# Altium schematic sheet 四路电压输入比较器.SchDoc
size 228 x 127 mm
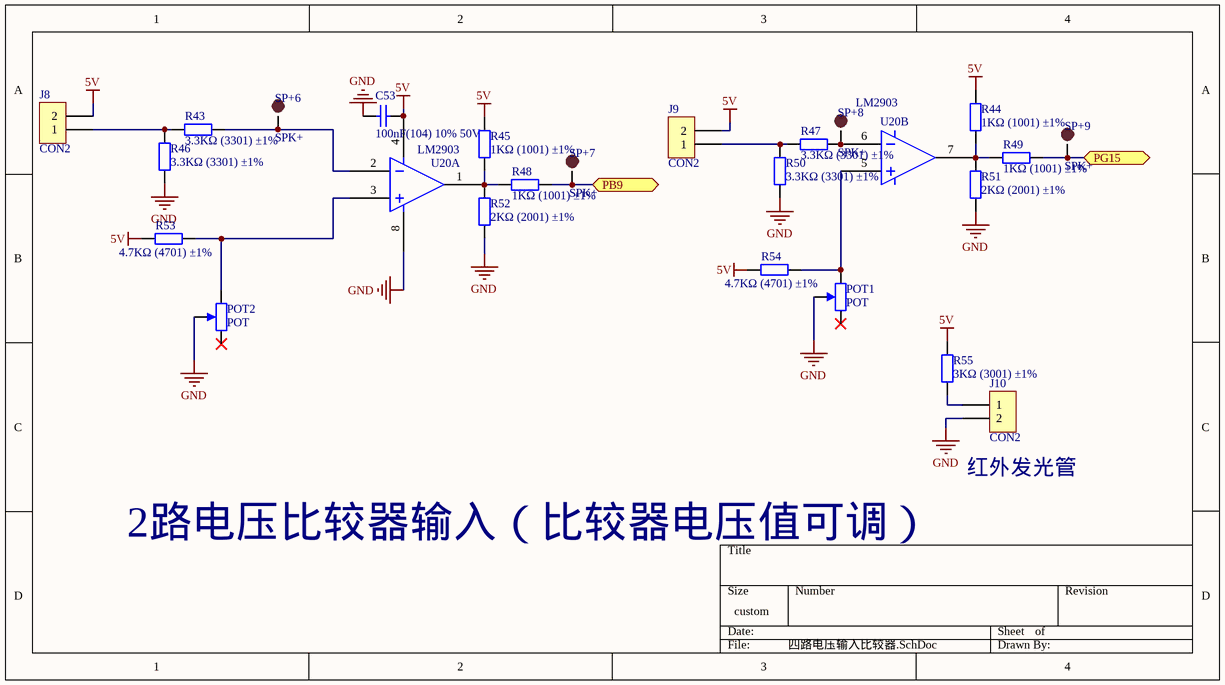
[diagram p0: 四路电压输入比较器.SchDoc]

## Parts
C53  100nF(104) 10% 50V  [0805_C]
J8  CON2  [XH2.54-2P]
J9  CON2  [XH2.54-2P]
J10  CON2  [XH2.54-2P]
POT1  POT  [R09-5K]
POT2  POT  [R09-5K]
R43  3.3KΩ (3301) ±1%  [0805_R]
R44  1KΩ (1001) ±1%  [0805_R]
R45  1KΩ (1001) ±1%  [0805_R]
R46  3.3KΩ (3301) ±1%  [0805_R]
R47  3.3KΩ (3301) ±1%  [0805_R]
R48  1KΩ (1001) ±1%  [0805_R]
R49  1KΩ (1001) ±1%  [0805_R]
R50  3.3KΩ (3301) ±1%  [0805_R]
R51  2KΩ (2001) ±1%  [0805_R]
R52  2KΩ (2001) ±1%  [0805_R]
R53  4.7KΩ (4701) ±1%  [0805_R]
R54  4.7KΩ (4701) ±1%  [0805_R]
R55  3KΩ (3001) ±1%  [0805_R]
SP+6  SPK+  [TP-1.5]
SP+7  SPK+  [TP-1.5]
SP+8  SPK+  [TP-1.5]
SP+9  SPK+  [TP-1.5]
U20  LM2903  [SOP-8]  (parts A,B of 2)

## Ports
PB9, PG15

## Nets
5V: C53.1 J8.2 J9.2 R44.2 R45.2 R53.1 R54.1 R55.2 U20.4
GND: C53.2 J10.2 POT1.2 POT2.2 R46.1 R50.1 R51.1 R52.1 U20.8
PB9: R48.1 SP+7.1 ; port PB9
PG15: R49.1 SP+9.1 ; port PG15
NetJ8_1: J8.1 R43.2 R46.2
NetJ9_1: J9.1 R47.2 R50.2
NetJ10_1: J10.1 R55.1
NetPOT1_3: POT1.3 R54.2 U20.5
NetPOT2_3: POT2.3 R53.2 U20.3
NetR43_1: R43.1 SP+6.1 U20.2
NetR44_1: R44.1 R49.2 R51.2 U20.7
NetR45_1: R45.1 R48.2 R52.2 U20.1
NetR47_1: R47.1 SP+8.1 U20.6

Not connected (* = marked no-connect by the designer): POT1 1*; POT2 1*

## Notes on the sheet
- (near J10) 红外发光管
- 2路电压比较器输入（比较器电压值可调）

## Library data of the parts
C53 = 0805 100nF(104) 10% 50V: 贴片电容; ComponentLink1Description: 供应商链接; ComponentLink1URL: http://www.szlcsc.com/product/details_50686.html; Package: 0805; Supplier: LC; SuppliersPartNumber: C49678
J8-J10 = CON2: 连接器
POT1 POT2 = POT: Potentiometer
R43 R46 R47 R50 = 0805 3.3KΩ (3301) 1%: 贴片电阻; ComponentLink1Description: 供应商链接; ComponentLink1URL: http://www.szlcsc.com/product/details_26753.html; Package: 0805; Supplier: LC; SuppliersPartNumber: C26010
R44 R45 R48 R49 = 0805 1KΩ (1001) 1%: 贴片电阻; ComponentLink1Description: 供应商链接; ComponentLink1URL: http://www.szlcsc.com/product/details_18201.html; Package: 0805; Supplier: LC; SuppliersPartNumber: C17513
R51 R52 = 0805 2KΩ (2001) 1%: 贴片电阻; ComponentLink1Description: 供应商链接; ComponentLink1URL: http://www.szlcsc.com/product/details_18292.html; Package: 0805; Supplier: LC; SuppliersPartNumber: C17604
R53 R54 = 0805 4.7KΩ (4701) 1%: 贴片电阻; ComponentLink1Description: 供应商链接; ComponentLink1URL: http://www.szlcsc.com/product/details_18361.html; Package: 0805; Supplier: LC; SuppliersPartNumber: C17673
R55 = 0805 3KΩ (3001) 1%: 贴片电阻; ComponentLink1Description: 供应商链接; ComponentLink1URL: http://www.szlcsc.com/product/details_18349.html; Package: 0805; Supplier: LC; SuppliersPartNumber: C17661
SP+6-SP+9 = TEST-POINT: 测试点
U20 = LM193